# EAGLE design SAO-232 (EAGLE 9.3.2)
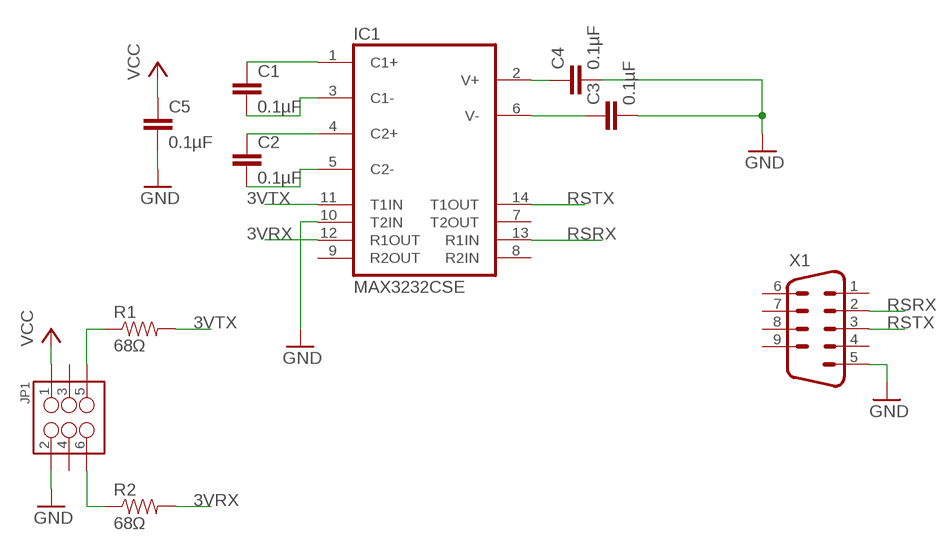
[diagram p0: schematic, sheet 1]

## Parts
C1  0.1µF  CAP0805  [0805]
C2  0.1µF  CAP0805  [0805]
C3  0.1µF  CAP0805  [0805]
C4  0.1µF  CAP0805  [0805]
C5  0.1µF  CAP0805  [0805]
IC1  MAX3232CSE  [SO16]
JP1  M03X2NO_SILK  [2X3-NS]
R1  68Ω  RESISTOR0805-RES  [0805]
R2  68Ω  RESISTOR0805-RES  [0805]
X1  M09D  [M09D]

## Nets
3VRX: IC1.12(R1OUT) R2.2
3VTX: IC1.11(T1IN) R1.2
GND: C3.2 C4.2 C5.2 IC1.10(T2IN) JP1.2 X1.5
N$1: C1.1 IC1.1(C1+)
N$2: C1.2 IC1.3(C1-)
N$3: C2.1 IC1.4(C2+)
N$4: C2.2 IC1.5(C2-)
N$5: C3.1 IC1.6(V-)
N$6: C4.1 IC1.2(V+)
N$7: JP1.5 R1.1
N$8: JP1.6 R2.1
RSRX: IC1.13(R1IN) X1.2
RSTX: IC1.14(T1OUT) X1.3
VCC: C5.1 JP1.1
Unconnected: IC1.7(T2OUT) IC1.8(R2IN) IC1.9(R2OUT) JP1.3 JP1.4 X1.1 X1.4 X1.6 X1.7 X1.8 X1.9

## Power pins joined to a net without a drawn wire
GND: IC1.15(GND)
VCC: IC1.16(VCC)

## Library data of the parts
C1-C5 = SparkFun-Capacitors:CAP: Capacitor Standard 0603 ceramic capacitor, and 0.1" leaded capacitor.
IC1 = maxim:MAX3232*: True RS-232 Transceivers 3.0V to 5.5V, Low-Power up to 1Mbps, Using Four 0.1µF External Capacitors Source: http://pdfserv.maxim-ic.com/en/ds/MAX3222-MAX3241.pdf; MPN: MAX3232CSE; OC_FARNELL: 9725490; OC_NEWARK: 90C2890
JP1 = SparkFun-Connectors-new:M03X2: 2x3 .1" header. Shrouded, with keying- CONN-10681 SMT- CONN-11415 Pogo pins- HW-11044
R1 R2 = SparkFun-Resistors:RESISTOR: Resistor Basic schematic elements and footprints for 0603, 1206, and PTH resistors.
X1 = con-subd:M09: SUB-D; OC_FARNELL: unknown; OC_NEWARK: unknown

## Board
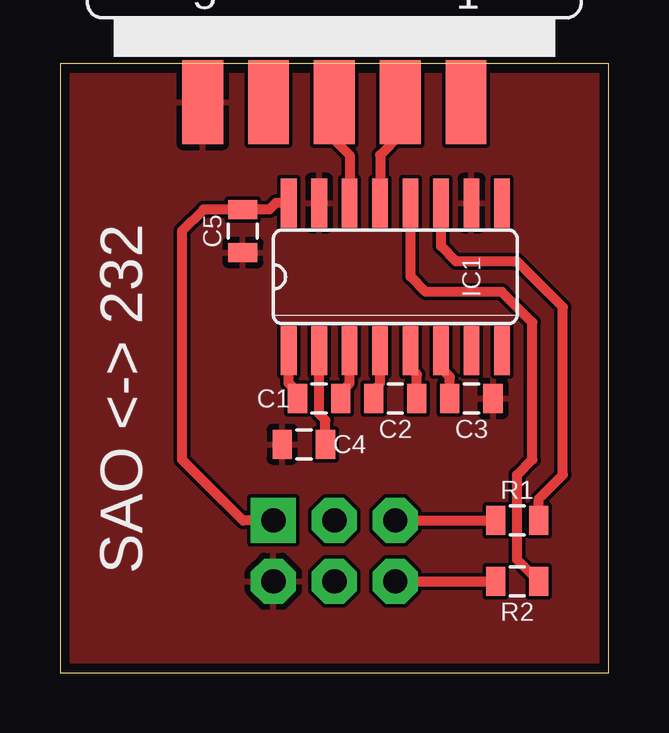
[diagram p1: board, top side]
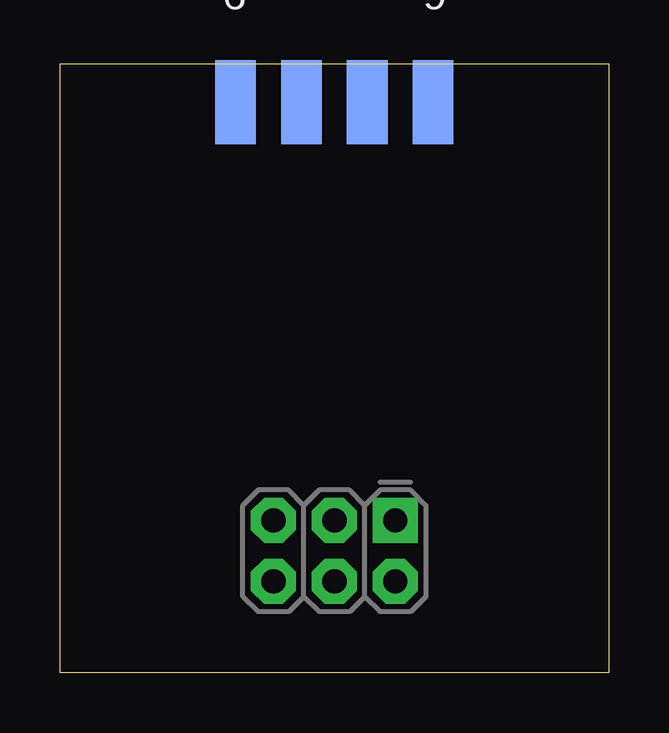
[diagram p2: board, bottom side, seen from below]

Size 22.86 x 25.4 mm. Coordinates in mm from the lower left corner, seen from the top.
Outline: 0,0 22.86,0 22.86,25.4 0,25.4 0,0
Copper layers (1*16): Top 0.035559375mm / dielectric 1.6mm / Bottom 0.035559375mm
Design rules "oshpark-2layer": minimum track width 6mil, minimum drill 10mil, track to track 6mil, track to pad 6mil, pad to pad 6mil, via to via 6mil, smd to smd 6mil, copper to edge 15mil, drill to drill 6mil, minimum pad ring 5mil, minimum via ring 5mil, stop-mask expansion 2.5mil, vias tented up to drill 20mil, thermal gap 10mil

### Footprints (pad centres in the part's own frame; a part is rotated, then mirrored left to right if it is on the bottom)
0805 = smd 0.8 x 1.2: 1 -0.9,0; 2 0.9,0
SO16 = smd 0.66 x 2.032: 1 -4.445,-3.073; 2 -3.175,-3.073; 3 -1.905,-3.073; 4 -0.635,-3.073; 5 0.635,-3.073; 6 1.905,-3.073; 7 3.175,-3.073; 8 4.445,-3.073; 9 4.445,3.073; 10 3.175,3.073; 11 1.905,3.073; 12 0.635,3.073; 13 -0.635,3.073; 14 -1.905,3.073; 15 -3.175,3.073; 16 -4.445,3.073
2X3-NS = drill 1.016 pad 1.88 square: 1 -2.54,-1.27 | drill 1.016 pad 1.88 octagon: 2 -2.54,1.27; 3 0,-1.27; 4 0,1.27; 5 2.54,-1.27; 6 2.54,1.27
M09D = smd 1.7 x 3.5: 1 5.486,-6.045; 2 2.743,-6.045; 3 0,-6.045; 4 -2.743,-6.045; 5 -5.486,-6.045 | smd 1.7 x 3.5 bottom: 6 4.115,-6.045; 7 1.372,-6.045; 8 -1.372,-6.045; 9 -4.115,-6.045

### Placement (x,y rotation side)
C1  10.79,11.43 0 top
C2  13.97,11.43 0 top
C3  17.14,11.43 0 top
C4  10.16,9.53 180 top
C5  7.62,18.41 270 top
IC1  13.97,16.51 0 top
JP1  11.43,5.08 180 bottom
R1  19.05,6.35 0 top
R2  19.05,3.81 0 top
X1  11.43,29.84 0 top

### Tracks (layer width: path | path; a pad name or v marks a point on that pad's centre or on a via)
3VRX
  Top 0.406: R2.2 19.05,4.71 19.05,8.26 19.68,8.89 19.68,14.61 18.41,15.88 15.24,15.88 14.61,16.51 IC1.12
3VTX
  Top 0.406: R1.2 19.95,7.25 20.95,8.26 20.95,15.24 19.05,17.14 16.51,17.14 15.88,17.78 IC1.11
GND
  pour Top: 0,0 0,25.4 22.86,25.4 22.86,0
N$1
  Top 0.406: C1.1 9.89,11.7 9.53,12.06 IC1.1
N$2
  Top 0.406: C1.2 11.7,11.7 12.06,12.06 IC1.3
N$3
  Top 0.406: C2.1 13.07,11.8 13.34,12.06 IC1.4
N$4
  Top 0.406: C2.2 14.87,12.44 14.61,12.7 IC1.5
N$5
  Top 0.406: C3.1 16.25,12.33 15.88,12.7 IC1.6
N$6
  Top 0.406: IC1.2 10.79,10.79 11.06,10.53 C4.1
N$7
  Top 0.406: JP1.5 R1.1
N$8
  Top 0.406: JP1.6 R2.1
RSRX
  Top 0.406: X1.2 14.17,22.43 13.34,21.59 IC1.13
RSTX
  Top 0.406: X1.3 11.43,22.23 12.06,21.59 IC1.14
VCC
  Top 0.406: IC1.16 8.99,19.58 8.72,19.32 C5.1 5.98,19.32 5.08,18.41 5.08,8.89 7.62,6.35 JP1.1

### Text on the board
tNames: SAO <-> 232